# EAGLE design CENTRAL HUB MODIFIED (EAGLE 7.6.0)
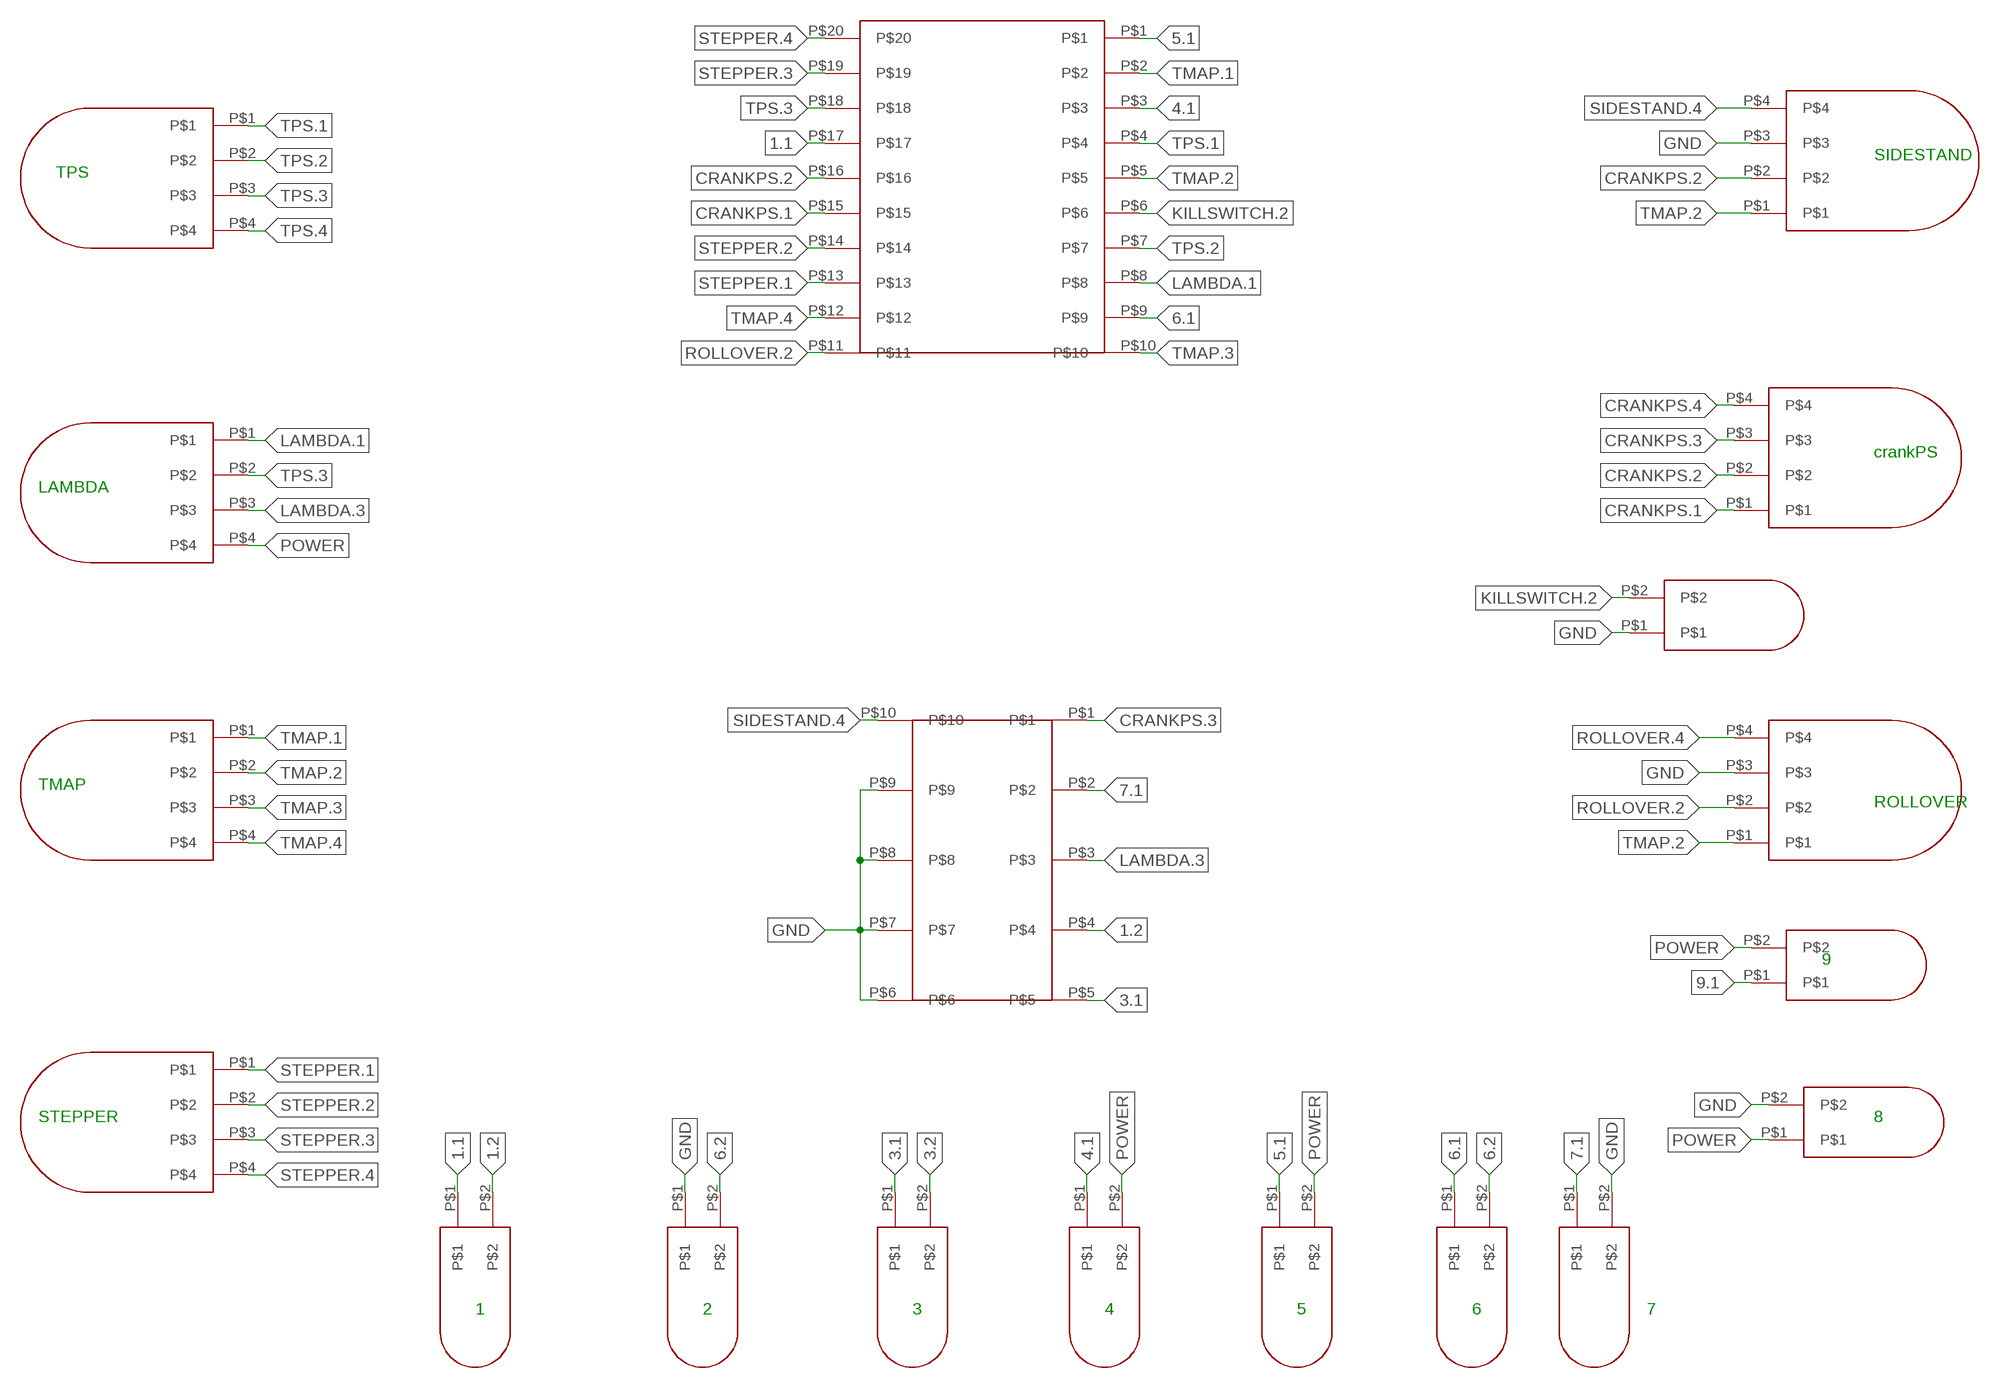
[diagram p0: schematic, sheet 1]

## Parts
1  2-PIN  [2PIN]
2  2-PIN  [2PIN]
3  2-PIN  [2PIN]
4  2-PIN  [2PIN]
5  2-PIN  [2PIN]
6  2-PIN  [2PIN]
7  2-PIN  [2PIN]
8  2-PIN  [2PIN]
9  2-PIN  [2PIN]
CRANK  4-PIN  [4PIN]
KILLSWITCH  2-PIN  [2PIN]
LAMBDA  4-PIN  [4PIN]
ROLLOVER  4-PIN  [4PIN]
SIDESTAND  4-PIN  [4PIN]
STEPPER  4-PIN  [4PIN]
TMAP  4-PIN  [4PIN]
TPS  4-PIN  [4PIN]
U$1  ECU1-20  [ECU]
U$2  ECU2-10  [10PIN]

## Nets
1.1: 1.P$1 U$1.P$17
1.2: 1.P$2 U$2.P$4
3.1: 3.P$1 U$2.P$5
3.2: 3.P$2
4.1: 4.P$1 U$1.P$3
5.1: 5.P$1 U$1.P$1
6.1: 6.P$1 U$1.P$9
6.2: 2.P$2 6.P$2
7.1: 7.P$1 U$2.P$2
9.1: 9.P$1
CRANKPS.1: CRANK.P$1 U$1.P$15
CRANKPS.2: CRANK.P$2 SIDESTAND.P$2 U$1.P$16
CRANKPS.3: CRANK.P$3 U$2.P$1
CRANKPS.4: CRANK.P$4
GND: 2.P$1 7.P$2 8.P$2 KILLSWITCH.P$1 ROLLOVER.P$3 SIDESTAND.P$3 U$2.P$6 U$2.P$7 U$2.P$8 U$2.P$9
KILLSWITCH.2: KILLSWITCH.P$2 U$1.P$6
LAMBDA.1: LAMBDA.P$1 U$1.P$8
LAMBDA.3: LAMBDA.P$3 U$2.P$3
POWER: 4.P$2 5.P$2 8.P$1 9.P$2 LAMBDA.P$4
ROLLOVER.2: ROLLOVER.P$2 U$1.P$11
ROLLOVER.4: ROLLOVER.P$4
SIDESTAND.4: SIDESTAND.P$4 U$2.P$10
STEPPER.1: STEPPER.P$1 U$1.P$13
STEPPER.2: STEPPER.P$2 U$1.P$14
STEPPER.3: STEPPER.P$3 U$1.P$19
STEPPER.4: STEPPER.P$4 U$1.P$20
TMAP.1: TMAP.P$1 U$1.P$2
TMAP.2: ROLLOVER.P$1 SIDESTAND.P$1 TMAP.P$2 U$1.P$5
TMAP.3: TMAP.P$3 U$1.P$10
TMAP.4: TMAP.P$4 U$1.P$12
TPS.1: TPS.P$1 U$1.P$4
TPS.2: TPS.P$2 U$1.P$7
TPS.3: LAMBDA.P$2 TPS.P$3 U$1.P$18
TPS.4: TPS.P$4

## Notes on the sheet
- SIDESTAND
- TPS
- crankPS
- LAMBDA
- TMAP
- ROLLOVER
- 9
- STEPPER | 8
- 1 | 2 | 3 | 4 | 5 | 6 | 7

## Library data of the parts
1-9 KILLSWITCH = HYPERION BLOCKS:2-PIN
CRANK LAMBDA ROLLOVER SIDESTAND STEPPER TMAP TPS = HYPERION BLOCKS:4-PIN
U$1 = HYPERION BLOCKS:ECU1-20
U$2 = HYPERION BLOCKS:ECU2-10

## Board
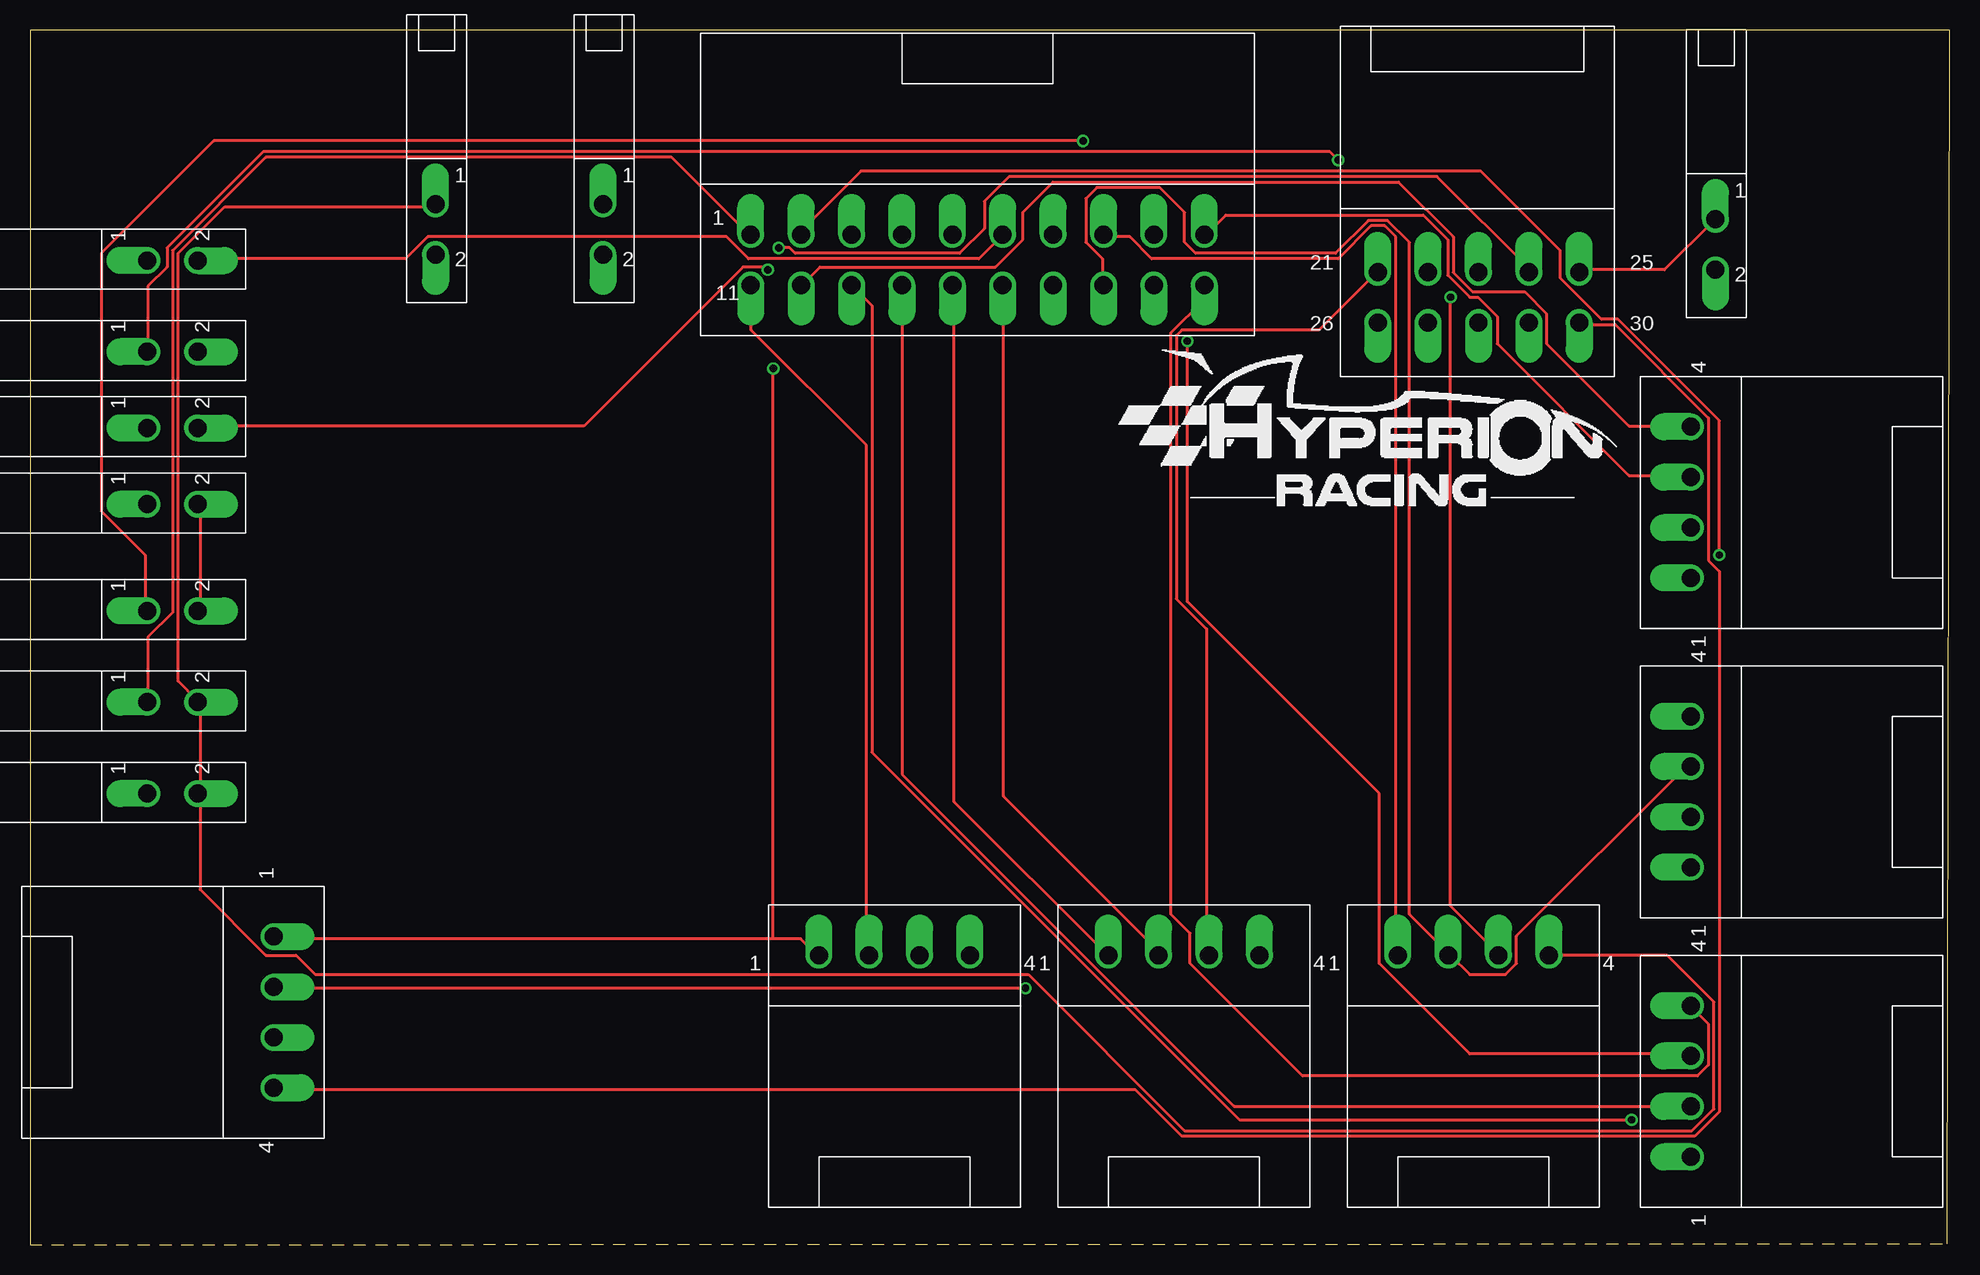
[diagram p1: board, top side]
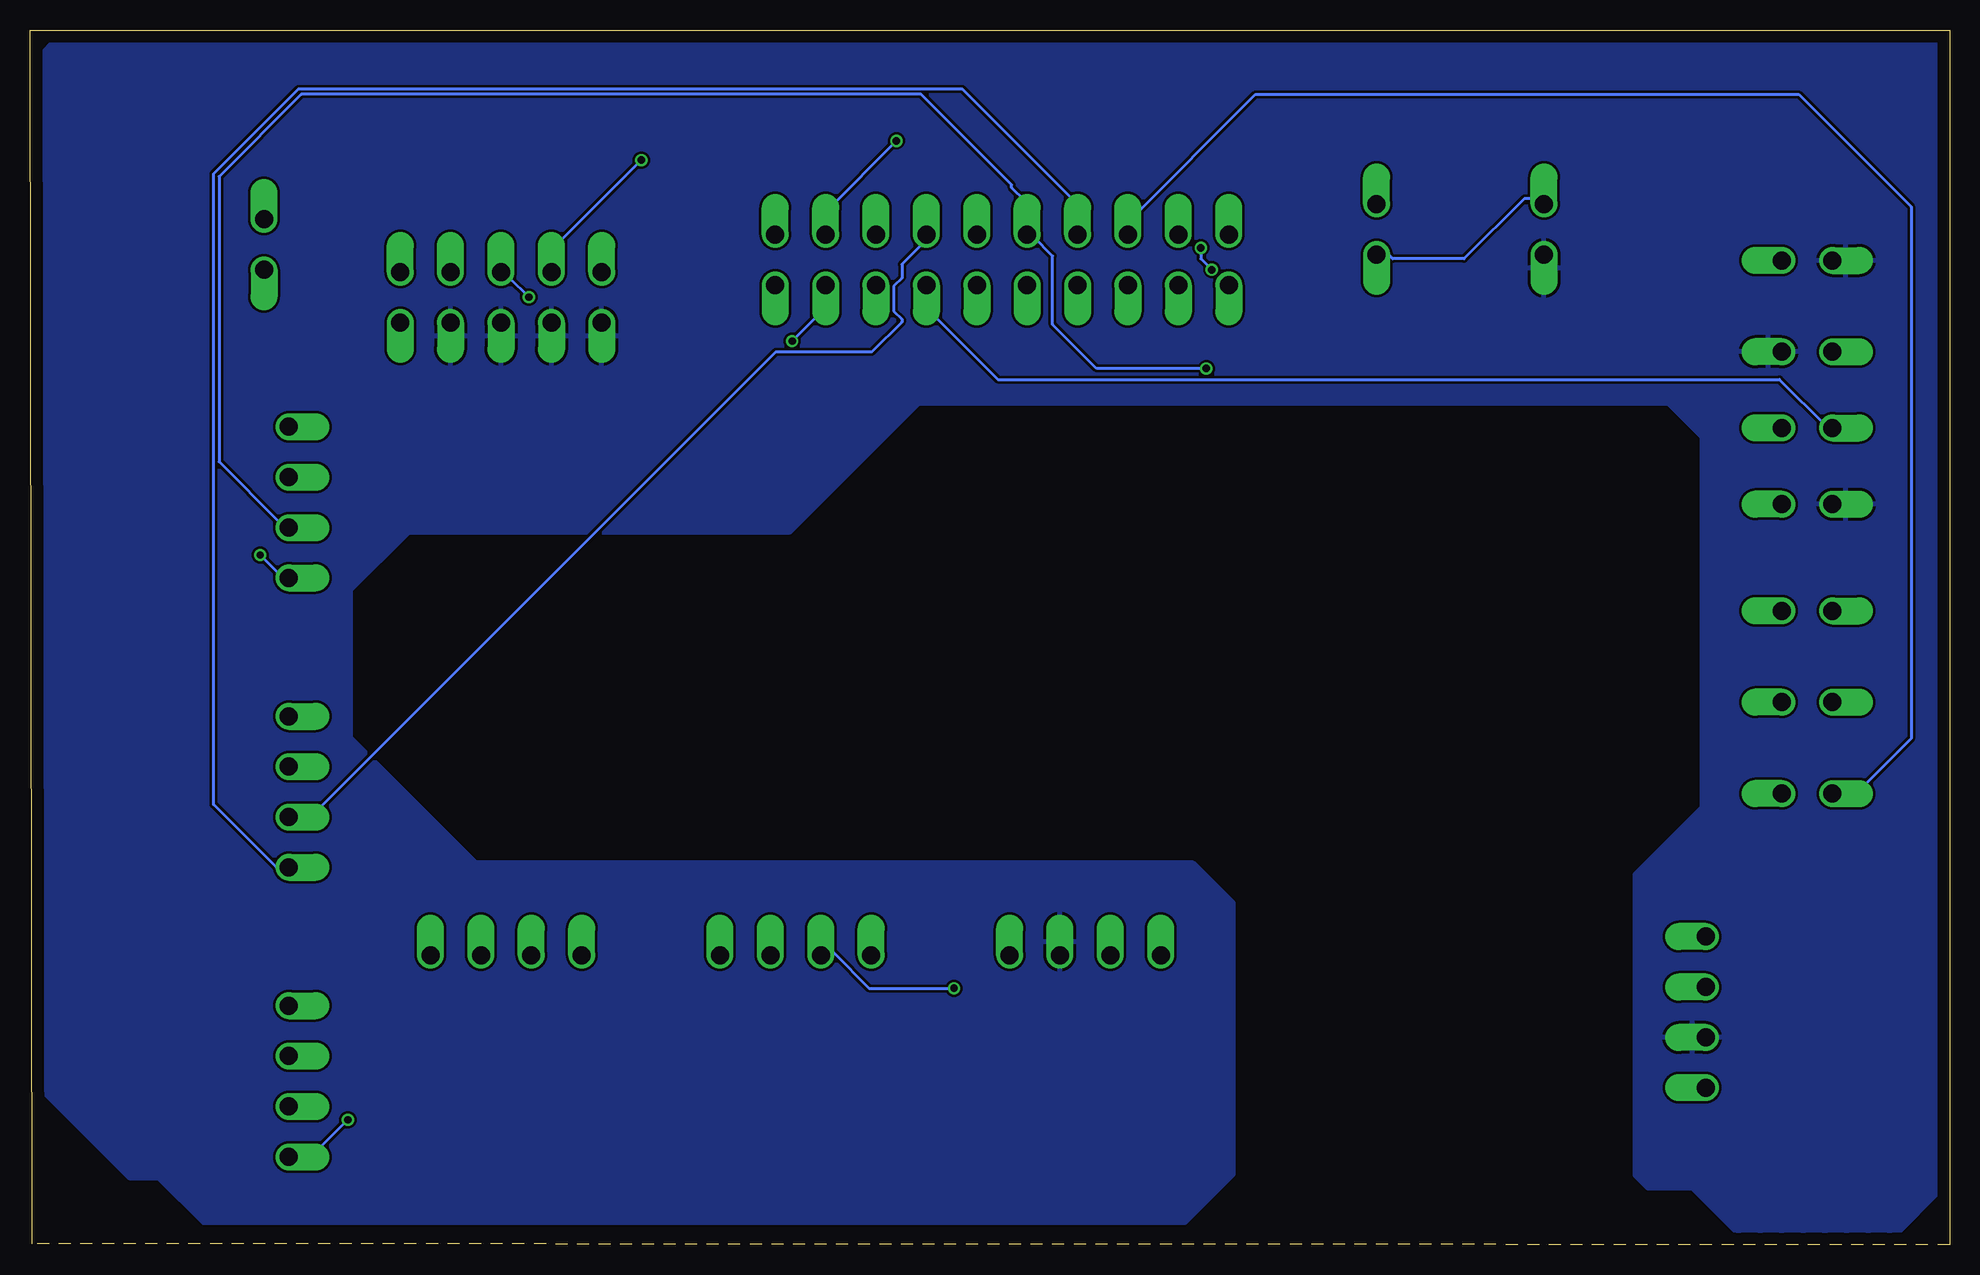
[diagram p2: board, bottom side, seen from below]

Size 160 x 101.27 mm. Coordinates in mm from the lower left corner, seen from the top.
Outline: 0,0 159.83,0.08 160,101.27 0,101.27 0,0
Copper layers (1*16): Top 0.035mm / dielectric 1.5mm / Bottom 0.035mm
Design rules "default": minimum track width 10mil, minimum drill 24mil, track to track 8mil, track to pad 8mil, pad to pad 8mil, via to via 8mil, smd to smd 8mil, copper to edge 40mil, drill to drill 8mil, minimum pad ring 10mil, minimum via ring 8mil, stop-mask expansion 4mil, vias tented up to drill 0mil, thermal gap 10mil

### Footprints (pad centres in the part's own frame; a part is rotated, then mirrored left to right if it is on the bottom)
2PIN = drill 1.5 offset: P$1 8.4,4.2; P$2 8.4,0
4PIN = drill 1.5 offset: P$1 16.8,0; P$2 12.6,0; P$3 8.4,0; P$4 4.2,0
ECU = drill 1.5 pad 2.184 offset: P$1 4.2,4.2; P$2 8.4,4.2; P$3 12.6,4.2; P$4 16.8,4.2; P$5 21,4.2; P$6 25.2,4.2; P$7 29.4,4.2; P$8 33.6,4.2; P$9 37.8,4.2; P$10 42,4.2; P$11 4.2,0; P$12 8.4,0; P$13 12.6,0; P$14 16.8,0; P$15 21,0; P$16 25.2,0; P$17 29.4,0; P$18 33.6,0; P$19 37.8,0; P$20 42,0
10PIN = drill 1.5 offset: P$1 3.12,4.88; P$2 7.32,4.88; P$3 11.52,4.88; P$4 15.72,4.88; P$5 19.92,4.88; P$6 3.12,0.68; P$7 7.32,0.68; P$8 11.52,0.68; P$9 15.72,0.68; P$10 19.92,0.68

### Placement (x,y rotation side)
1  13.97,59.69 90 top
2  13.97,53.34 90 top
3  132.08,81.28 0 top
4  13.97,29.21 90 top
5  13.97,36.83 90 top
6  13.97,44.45 90 top
7  13.97,66.04 90 top
8  25.4,82.55 0 top
9  39.37,82.55 0 top
CRANK  106.68,24.13 180 top
KILLSWITCH  13.97,73.66 90 top
LAMBDA  130.81,24.13 180 top
ROLLOVER  82.55,24.13 180 top
SIDESTAND  20.32,8.89 90 top
STEPPER  138.43,24.13 270 top
TMAP  138.43,72.39 270 top
TPS  138.43,48.26 270 top
U$1  55.88,80.01 0 top
U$2  109.22,76.2 0 top

### Tracks (layer width: path | path; a pad name or v marks a point on that pad's centre or on a via)
1.1
  Bottom 0.254: 1.P$1 9.83,68.25 10.29,68.25 14.17,72.14 79.32,72.14 85.27,78.08 85.27,79.91 U$1.P$17
1.2  (via drill 0.61)
  Top 0.254: v61.49,81.28 61.27,81.51 59.44,81.51 46.18,68.25 14.17,68.25 1.P$2 | v62.41,83.11 63.32,83.11 63.78,82.65 77.5,82.65 79.55,84.71 79.55,86.99 81.61,89.05 117.27,89.05 125.04,81.28 U$2.P$4
  Bottom 0.254: v61.49,81.28 62.41,82.19 v62.41,83.11
3.1
  Top 0.254: U$2.P$5 129.16,81.28 136.25,81.28 140.36,85.39 3.P$1
4.1
  Bottom 0.254: 4.P$1 9.6,37.62 7.77,37.62 3.2,42.19 3.2,86.54 12.57,95.91 57.84,95.91 68.35,85.39 68.35,84.25 U$1.P$3
5.1
  Top 0.254: 5.P$1 9.83,45.39 9.83,50.65 11.89,52.71 11.89,82.88 19.66,90.65 53.49,90.65 59.89,84.25 U$1.P$1
6.1  (via drill 0.61)
  Top 0.254: v87.78,92.02 15.32,92.02 5.94,82.65 5.94,61.16 9.6,57.51 9.6,52.93 6.P$1
  Bottom 0.254: v87.78,92.02 93.5,86.31 93.5,84.25 U$1.P$9
6.2
  Top 0.254: 6.P$2 14.17,52.93 14.17,61.62 2.P$2
7.1  (via drill 0.61)
  Top 0.254: v109.04,90.42 108.36,91.11 19.43,91.11 11.43,83.11 11.43,81.51 9.83,79.91 9.83,74.65 7.P$1
  Bottom 0.254: v109.04,90.42 116.36,83.11 116.36,81.28 U$2.P$2
CRANKPS.1
  Top 0.254: U$1.P$15 77.04,79.91 77.04,36.93 89.84,24.13 CRANK.P$1
CRANKPS.2  (via drill 0.61)
  Top 0.254: v82.98,21.39 20.34,21.39 SIDESTAND.P$2 | U$1.P$16 81.15,79.91 81.15,37.39 93.95,24.59 93.95,24.13 CRANK.P$2
  Bottom 0.254: v82.98,21.39 90.07,21.39 93.04,24.36 93.73,24.36 93.95,24.13 CRANK.P$2
CRANKPS.3
  Top 0.254: CRANK.P$3 98.07,24.13 98.07,51.33 95.56,53.85 95.56,75.79 96.01,76.25 107.44,76.25 112.24,81.05 U$2.P$1
GND
  pour Bottom: 0.34,100.83 157.46,100.83 159.58,98.71 159.58,13.46 151.71,5.59 149.25,5.59 145.53,1.86 63.75,1.86 59.68,5.93 59.68,28.45 63.07,31.83 122.84,31.83 133.25,42.24 133.25,54.6 128.43,59.43 96.68,59.43 85.93,70.18 23.45,70.18 20.66,67.39 20.66,36.4 26.24,30.82 26.24,5.84 25.14,4.74 21.42,4.74 17.69,1.02 4.32,1.02 0.85,4.49 0.85,33.86 -0.08,34.79 -0.08,40.97 0.25,41.31 0.25,100.74
KILLSWITCH.2
  Top 0.254: KILLSWITCH.P$2 14.17,82.19 31.32,82.19 33.15,84.02 58.06,84.02 59.89,82.19 79.1,82.19 80.92,84.02 U$1.P$6
LAMBDA.1
  Top 0.254: U$1.P$8 89.61,84.02 91.67,84.02 93.5,82.19 109.04,82.19 111.78,84.94 112.93,84.94 113.84,84.02 113.84,24.13 LAMBDA.P$1
LAMBDA.3  (via drill 0.61)
  Top 0.254: v118.42,78.99 118.42,28.25 122.53,24.13 LAMBDA.P$3
  Bottom 0.254: v118.42,78.99 120.02,80.59 120.24,80.59 120.7,81.05 U$2.P$3
POWER
  Top 0.254: LAMBDA.P$4 136.47,24.13 140.36,20.24 140.36,11.33 138.53,9.5 96.24,9.5 83.21,22.53 23.77,22.53 22.17,24.13 19.66,24.13 14.17,29.62 14.17,37.39 4.P$2 14.17,37.62 14.17,45.16 5.P$2 13.95,45.39 12.34,46.99 12.34,82.65 16.23,86.54 33.6,86.54 8.P$1
  Bottom 0.254: 9.P$2 47.55,82.42 46.63,82.42 46.41,82.19 40.46,82.19 35.43,87.22 34.29,87.22 33.83,86.77 8.P$1
ROLLOVER.2
  Top 0.254: U$1.P$11 60.12,79.91 60.12,76.25 69.72,66.65 69.72,24.13 ROLLOVER.P$2
SIDESTAND.4
  Top 0.254: SIDESTAND.P$4 20.34,12.93 92.13,12.93 96.01,9.04 138.76,9.04 140.82,11.1 140.82,56.13 139.9,57.05 139.9,68.94 132.13,76.71 129.16,76.71 U$2.P$10
STEPPER.1  (via drill 0.61)
  Top 0.254: v133.5,10.41 100.81,10.41 70.18,41.05 70.18,78.31 68.58,79.91 U$1.P$13
  Bottom 0.254: v133.5,10.41 136.47,7.44 138.3,7.44 STEPPER.P$1
STEPPER.2
  Top 0.254: STEPPER.P$2 138.3,11.56 100.36,11.56 72.69,39.22 72.69,79.91 U$1.P$14
STEPPER.3  (via drill 0.61)
  Top 0.254: v96.47,75.34 96.47,53.62 112.47,37.62 112.47,23.44 120.02,15.9 138.3,15.9 STEPPER.P$3
  Bottom 0.254: v96.47,75.34 93.73,78.08 93.73,79.91 U$1.P$19
STEPPER.4
  Top 0.254: U$1.P$20 97.84,79.91 97.84,78.77 95.1,76.02 95.1,27.56 96.7,25.96 96.7,23.44 106.07,14.07 138.99,14.07 139.9,14.99 139.9,18.41 138.53,19.79 STEPPER.P$4
TMAP.1  (via drill 0.61)
  Top 0.254: v140.82,57.51 140.82,68.71 132.36,77.16 130.99,77.16 127.56,80.59 127.56,82.88 120.93,89.51 69.27,89.51 64.47,84.71 64.47,84.25 U$1.P$2
  Bottom 0.254: v140.82,57.51 138.99,55.68 138.53,55.68 TMAP.P$1
TMAP.2  (via drill 0.61)
  Top 0.254: 61.95,25.5 64.24,25.5 65.61,24.13 ROLLOVER.P$1 | 61.95,25.5 20.34,25.5 SIDESTAND.P$1 | 61.95,25.5 v61.95,73.05
  Bottom 0.254: v61.95,73.05 71.09,73.05 74.75,76.71 74.75,82.42 76.35,84.02 76.81,84.02 U$1.P$5 77.04,84.25 77.04,86.99 78.18,88.14 78.18,88.37 85.72,95.91 137.39,95.91 144.25,89.05 144.25,65.28 139.22,60.25 138.99,60.25 138.53,59.79 TMAP.P$2
TMAP.3
  Top 0.254: TMAP.P$3 138.3,64.14 133.27,64.14 122.3,75.11 122.3,77.39 120.7,78.99 120.02,78.99 118.19,80.82 118.19,83.8 116.13,85.85 99.67,85.85 98.07,84.25 U$1.P$10
TMAP.4
  Top 0.254: TMAP.P$4 138.3,68.25 133.27,68.25 126.42,75.11 126.42,77.62 124.59,79.45 120.24,79.45 118.64,81.05 118.64,84.02 114.07,88.59 85.27,88.59 82.75,86.08 82.75,83.8 80.47,81.51 65.84,81.51 64.47,80.14 U$1.P$12
TPS.1
  Bottom 0.254: U$1.P$4 72.69,84.25 72.69,86.77 82.3,96.37 137.62,96.37 144.7,89.28 144.7,36.7 139.45,31.45 138.53,31.45 TPS.P$1
TPS.2
  Bottom 0.254: TPS.P$2 138.3,35.79 136.47,35.79 97.84,74.42 89.84,74.42 87.33,76.94 87.33,77.16 88.01,77.85 88.01,79.91 87.33,80.59 87.33,81.74 85.5,83.57 85.5,84.02 U$1.P$7
TPS.3
  Top 0.254: 118.42,24.13 114.99,27.56 114.99,83.57 113.16,85.39 111.56,85.39 108.81,82.65 97.16,82.65 96.24,83.57 96.24,86.08 94.18,88.14 88.92,88.14 88.01,87.22 88.01,83.57 89.38,82.19 89.38,80.14 U$1.P$18 | 118.42,24.13 120.02,22.53 122.99,22.53 123.9,23.44 123.9,25.73 137.85,39.68 138.3,39.68 TPS.P$3 | 118.42,24.13 LAMBDA.P$2

### Text on the board
Unrouted: power | 53 | IGNITION | KILLSWITCH | clutch | engine temp | fuel pump | TMAP | fuel relay | kill relay | injector | TPS | SIDESTAND | ROLLOVER | CRANK | LAMBDA | STEPPER